# Altium schematic sheet Hierarchical_Design.SchDoc: Hierarchical Design HSC12
size B; Date: 2015-02-08; Author: Marcin Czajkowski; CompanyName: Conestoga College; DrawnBy: Marcin Czajkowski; Organization: Marcin Czajkowski; Address1: SN:3547684; Address2: ESE-Y2; Address3: Conestoga College; Address4: Project IV; DocumentNumber: 14; Revision: D; SheetNumber: 14; SheetTotal: 14; ProjectName: Hierarchical Design HSC12
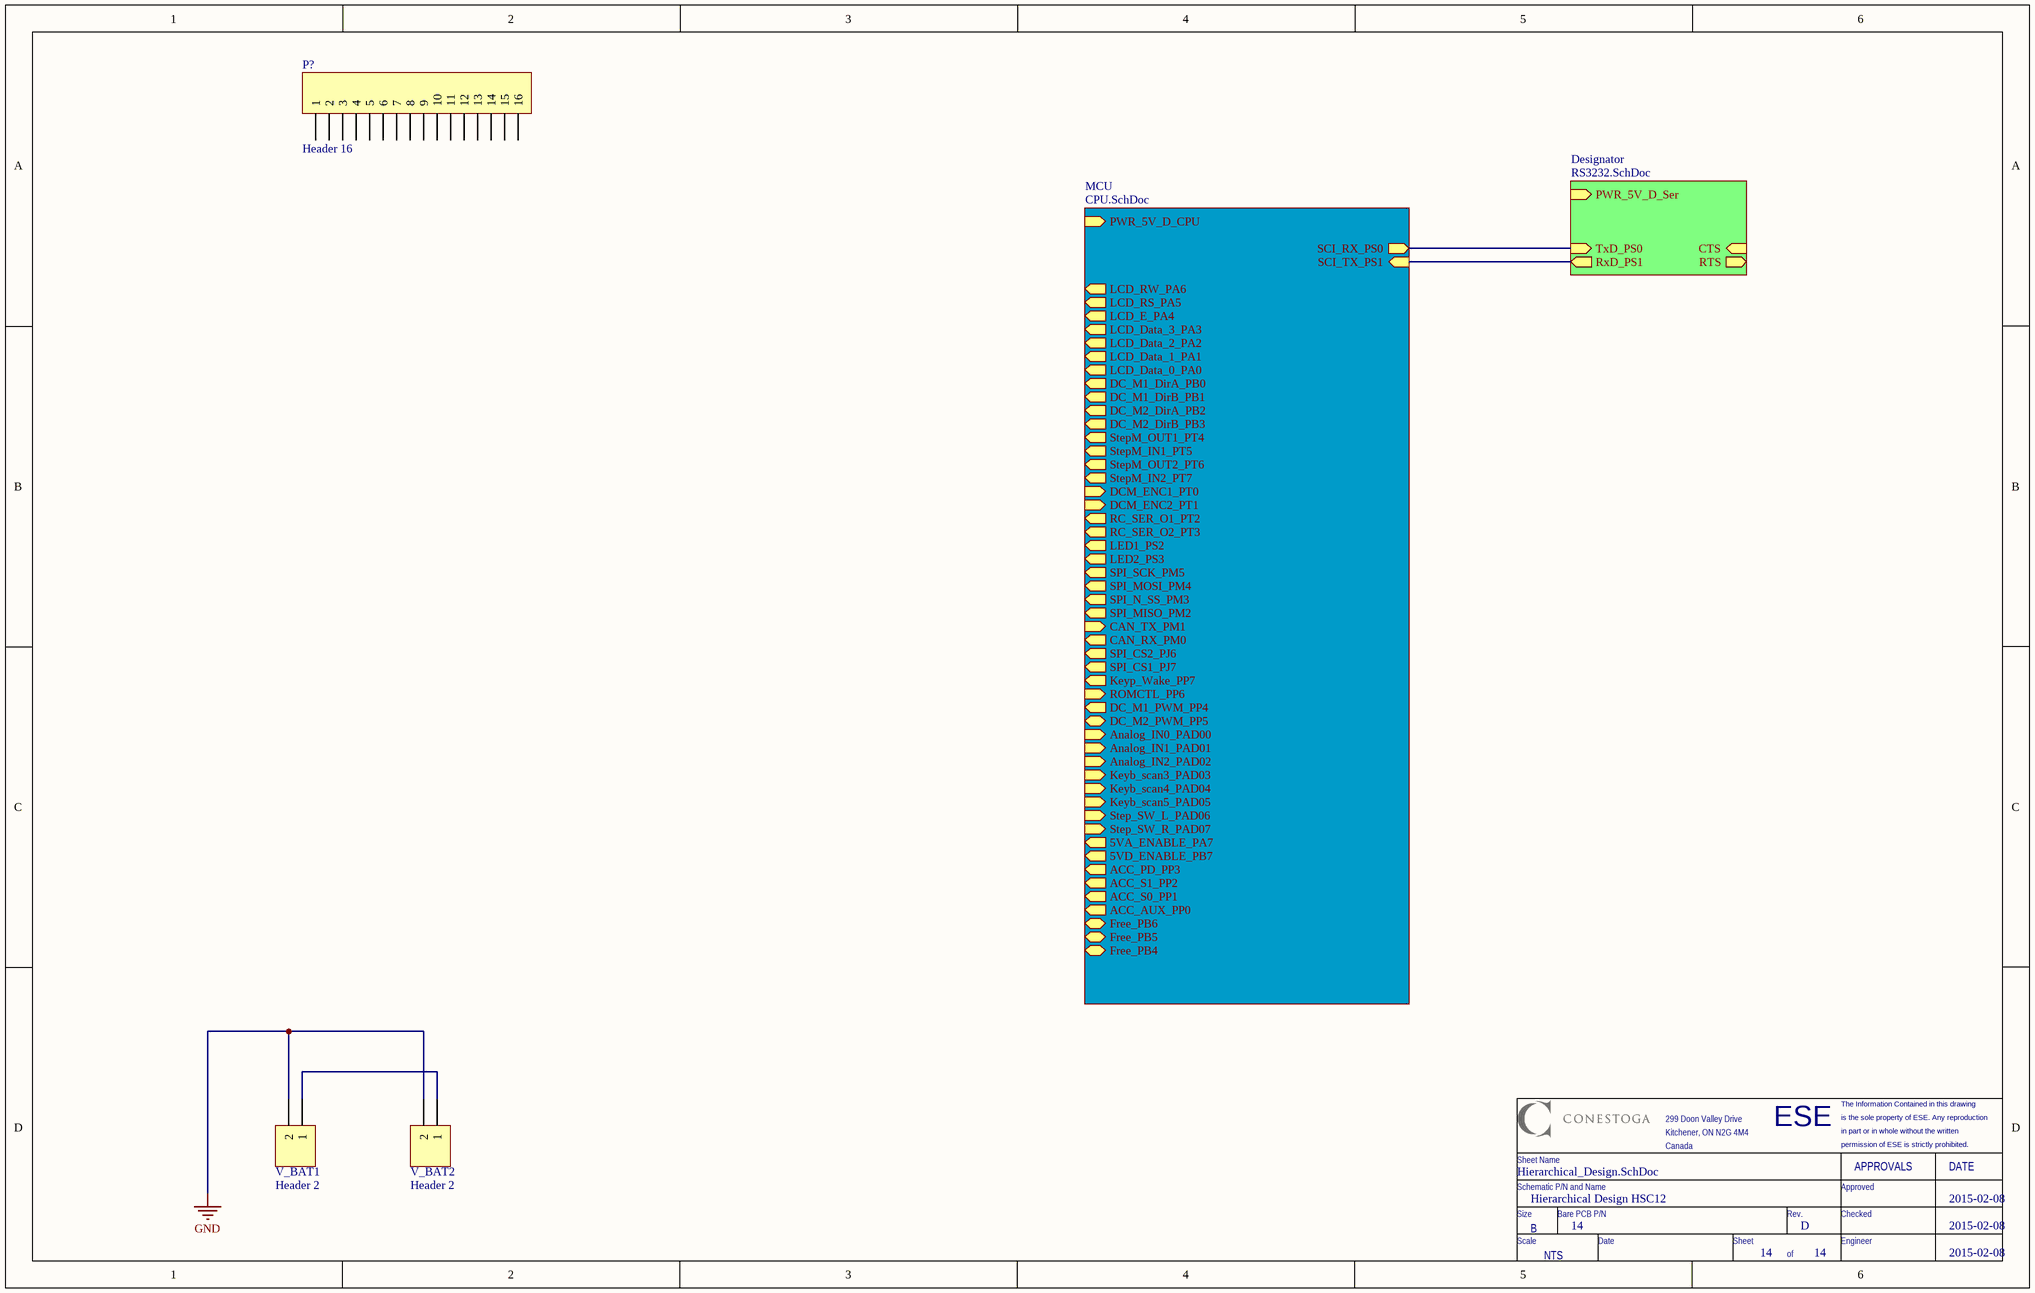
[diagram p0: Hierarchical_Design.SchDoc]

## Parts
P?  Header 16  [HDR1X16]
V_BAT1  Header 2  [HDR1X2]
V_BAT2  Header 2  [HDR1X2]

## Sub-sheets
Designator = RS3232.SchDoc: PWR_5V_D_Ser (in), TxD_PS0 (in), RxD_PS1 (out), CTS (in), RTS (out)
MCU = CPU.SchDoc: PWR_5V_D_CPU (in), SCI_RX_PS0 (out), SCI_TX_PS1 (in), LCD_RW_PA6 (out), LCD_RS_PA5 (out), LCD_E_PA4 (out), LCD_Data_3_PA3 (out), LCD_Data_2_PA2 (out), LCD_Data_1_PA1 (out), LCD_Data_0_PA0 (out), DC_M1_DirA_PB0 (out), DC_M1_DirB_PB1 (out), DC_M2_DirA_PB2 (out), DC_M2_DirB_PB3 (out), StepM_OUT1_PT4 (out), StepM_IN1_PT5 (out), StepM_OUT2_PT6 (out), StepM_IN2_PT7 (out), DCM_ENC1_PT0 (in), DCM_ENC2_PT1 (in), RC_SER_O1_PT2 (out), RC_SER_O2_PT3 (out), LED1_PS2 (out), LED2_PS3 (out), SPI_SCK_PM5 (out), SPI_MOSI_PM4 (out), SPI_N_SS_PM3 (out), SPI_MISO_PM2 (out), CAN_TX_PM1 (in), CAN_RX_PM0 (out), SPI_CS2_PJ6 (out), SPI_CS1_PJ7 (out), Keyp_Wake_PP7 (out), ROMCTL_PP6 (in), DC_M1_PWM_PP4 (out), DC_M2_PWM_PP5, Analog_IN0_PAD00 (in), Analog_IN1_PAD01 (in), Analog_IN2_PAD02 (in), Keyb_scan3_PAD03 (in), Keyb_scan4_PAD04 (in), Keyb_scan5_PAD05 (in), Step_SW_L_PAD06 (in), Step_SW_R_PAD07 (in), 5VA_ENABLE_PA7 (out), 5VD_ENABLE_PB7 (out), ACC_PD_PP3 (out), ACC_S1_PP2 (out), ACC_S0_PP1 (out), ACC_AUX_PP0 (out), Free_PB6 (bidir), Free_PB5 (bidir), Free_PB4 (bidir)

## Nets
GND: V_BAT1.2 V_BAT2.2
NetV_BAT1_1: V_BAT1.1 V_BAT2.1
(unnamed): sheet MCU/SCI_RX_PS0, sheet Designator/TxD_PS0
(unnamed): sheet MCU/SCI_TX_PS1, sheet Designator/RxD_PS1

Not connected (* = marked no-connect by the designer): P? 1 2 3 4 5 6 7 8 9 10 11 12 13 14 15 16

## Notes on the sheet
- ESE
- is the sole property of ESE. Any reproduction
- The Information Contained in this drawing
- Schematic P/N and Name
- Sheet Name
- 299 Doon Valley Drive
- Kitchener, ON N2G 4M4
- Canada
- Approved
- in part or in whole without the written
- permission of ESE is strictly prohibited.
- APPROVALS
- DATE
- Size
- Scale
- B
- NTS
- Bare PCB P/N
- Date
- Sheet
- Rev.
- Checked
- Engineer
- of

## Library data of the parts
P? = Header 16: Header, 16-Pin Female; MPN: PPPC161LFBN-RC; PN: S7049-ND; URL: http://www.digikey.ca/product-detail/en/PPPC161LFBN-RC/S7049-ND
V_BAT1 V_BAT2 = Header 2: Header, 2-Pin; MPN: PEC02SFAN; PN: S1212E-02-ND; URL: http://www.digikey.ca/product-detail/en/PEC04SFAN/S1212E-02-ND